# EAGLE design SC card holder v2.6 (EAGLE 8.3.1)
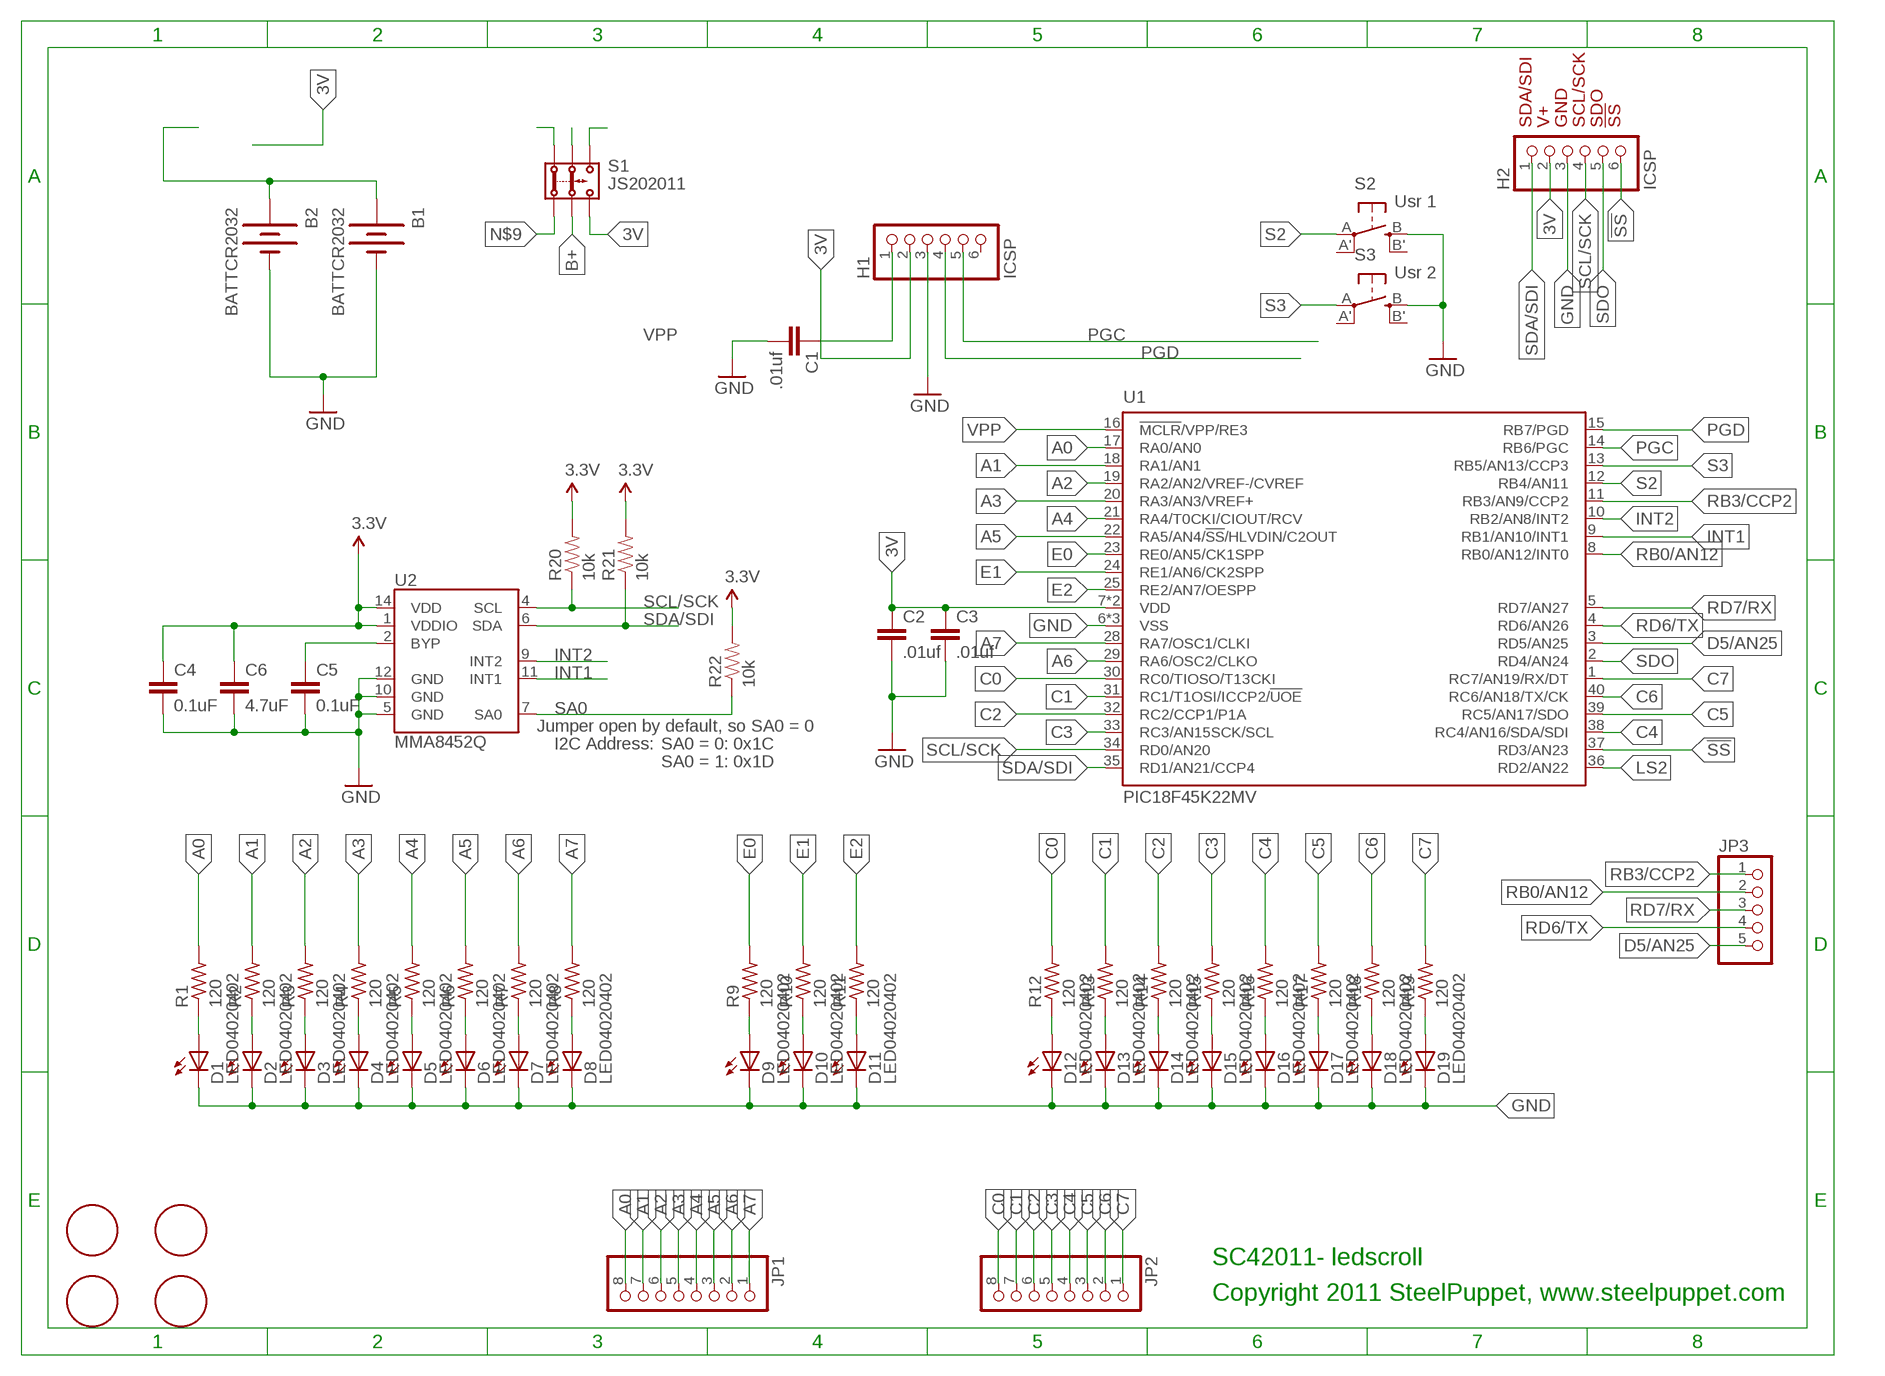
[diagram p0: schematic, sheet 1]

## Parts
B1  BATTCR2032  [BATT_CR1220_SMT]
B2  BATTCR2032  [BATT_CR1220_SMT]
C1  .01uf  CAP0402-CAP  [0402-CAP]
C2  .01uf  CAP0402-CAP  [0402-CAP]
C3  .01uf  CAP0402-CAP  [0402-CAP]
C4  0.1uF  CAP0402-CAP  [0402-CAP]
C5  0.1uF  CAP0402-CAP  [0402-CAP]
C6  4.7uF  CAP0402-CAP  [0402-CAP]
D1  LED04020402  [LED0402]
D2  LED04020402  [LED0402]
D3  LED04020402  [LED0402]
D4  LED04020402  [LED0402]
D5  LED04020402  [LED0402]
D6  LED04020402  [LED0402]
D7  LED04020402  [LED0402]
D8  LED04020402  [LED0402]
D9  LED04020402  [LED0402]
D10  LED04020402  [LED0402]
D11  LED04020402  [LED0402]
D12  LED04020402  [LED0402]
D13  LED04020402  [LED0402]
D14  LED04020402  [LED0402]
D15  LED04020402  [LED0402]
D16  LED04020402  [LED0402]
D17  LED04020402  [LED0402]
D18  LED04020402  [LED0402]
D19  LED04020402  [LED0402]
H1  ICSP  PINHD-1X06_2.54-S  [1X06-S]
H2  ICSP  PINHD-1X06_2.54-S  [1X06-S]
JP1  PINHD-1X08_2.54-S  [1X08-S]
JP2  PINHD-1X08_2.54-S  [1X08-S]
JP3  PINHD-1X05_2.54-S  [1X05-S]
R1  120  R-US_R0402  [R0402]
R2  120  R-US_R0402  [R0402]
R3  120  R-US_R0402  [R0402]
R4  120  R-US_R0402  [R0402]
R5  120  R-US_R0402  [R0402]
R6  120  R-US_R0402  [R0402]
R7  120  R-US_R0402  [R0402]
R8  120  R-US_R0402  [R0402]
R9  120  R-US_R0402  [R0402]
R10  120  R-US_R0402  [R0402]
R11  120  R-US_R0402  [R0402]
R12  120  R-US_R0402  [R0402]
R13  120  R-US_R0402  [R0402]
R14  120  R-US_R0402  [R0402]
R15  120  R-US_R0402  [R0402]
R16  120  R-US_R0402  [R0402]
R17  120  R-US_R0402  [R0402]
R18  120  R-US_R0402  [R0402]
R19  120  R-US_R0402  [R0402]
R20  10k  RESISTOR0402-RES  [0402-RES]
R21  10k  RESISTOR0402-RES  [0402-RES]
R22  10k  RESISTOR0402-RES  [0402-RES]
S1  JS202011  [JS202011SMT]
S2  Usr 1  SPST_TACT-EVQQ2  [EVQ-Q2]
S3  Usr 2  SPST_TACT-EVQQ2  [EVQ-Q2]
U1  PIC18F45K22MV  [QFN40-5X5]
U2  MMA8452Q  [QFN-16_0.5MM]
U$4  FID1.5  [FID1.5]
U$5  FID1.5  [FID1.5]
U$6  FID1.5  [FID1.5]
U$7  FID1.5  [FID1.5]

## Nets
3V: C2.1 C3.1 C4.1 C6.1 H1.2 H2.2 R20.2 R21.2 R22.2 S1.3(3.2) S1.4(3.1) U1.7(VDD) U1.26(VDD) U2.1(VDDIO) U2.14(VDD) ; supply symbol labelled 3.3V
!SS: H2.6 U1.37(RD3/AN23)
A0: JP1.8 R1.2 U1.17(RA0/AN0)
A1: JP1.7 R2.2 U1.18(RA1/AN1)
A2: JP1.6 R3.2 U1.19(RA2/AN2/VREF-/CVREF)
A3: JP1.5 R4.2 U1.20(RA3/AN3/VREF+)
A4: JP1.4 R5.2 U1.21(RA4/T0CKI/CIOUT/RCV)
A5: JP1.3 R6.2 U1.22(RA5/AN4/!SS!/HLVDIN/C2OUT)
A6: JP1.2 R7.2 U1.29(RA6/OSC2/CLKO)
A7: JP1.1 R8.2 U1.28(RA7/OSC1/CLKI)
B+: B1.1(+) B1.3(+) B2.1(+) B2.3(+) S1.2(2.2) S1.5(2.1)
BYP: C5.1 U2.2(BYP)
C0: JP2.8 R12.2 U1.30(RC0/TIOSO/T13CKI)
C1: JP2.7 R13.2 U1.31(RC1/T1OSI/ICCP2/!UOE)
C2: JP2.6 R14.2 U1.32(RC2/CCP1/P1A)
C3: JP2.5 R15.2 U1.33(RC3/AN15SCK/SCL)
C4: JP2.4 R16.2 U1.38(RC4/AN16/SDA/SDI)
C5: JP2.3 R17.2 U1.39(RC5/AN17/SDO)
C6: JP2.2 R18.2 U1.40(RC6/AN18/TX/CK)
C7: JP2.1 R19.2 U1.1(RC7/AN19/RX/DT)
D5/AN25: JP3.5 U1.3(RD5/AN25)
E0: R9.2 U1.23(RE0/AN5/CK1SPP)
E1: R10.2 U1.24(RE1/AN6/CK2SPP)
E2: R11.2 U1.25(RE2/AN7/OESPP)
GND: B1.2(-) B2.2(-) C1.2 C2.2 C3.2 C4.2 C5.2 C6.2 D1.C D2.C D3.C D4.C D5.C D6.C D7.C D8.C D9.C D10.C D11.C D12.C D13.C D14.C D15.C D16.C D17.C D18.C D19.C H1.3 H2.3 S2.B(S) S3.B(S) U1.6(VSS) U1.27(VSS) U1.41(VSS) U2.5(GND) U2.10(GND) U2.12(GND)
INT1: U1.9(RB1/AN10/INT1) U2.11(INT1)
INT2: U1.10(RB2/AN8/INT2) U2.9(INT2)
LS2: U1.36(RD2/AN22)
N$2: D1.A R1.1
N$3: D2.A R2.1
N$4: D3.A R3.1
N$5: D4.A R4.1
N$6: D9.A R9.1
N$7: D10.A R10.1
N$8: D11.A R11.1
N$9: S1.1(1.2)
N$11: D13.A R13.1
N$12: D14.A R14.1
N$13: D15.A R15.1
N$14: D12.A R12.1
N$15: S1.6(1.1)
N$18: D6.A R6.1
N$20: D7.A R7.1
N$21: D16.A R16.1
N$22: D17.A R17.1
N$23: D8.A R8.1
N$24: D5.A R5.1
N$25: D18.A R18.1
N$26: D19.A R19.1
PGC: H1.5 U1.14(RB6/PGC)
PGD: H1.4 U1.15(RB7/PGD)
RB0/AN12: JP3.2 U1.8(RB0/AN12/INT0)
RB3/CCP2: JP3.1 U1.11(RB3/AN9/CCP2)
RD6/TX: JP3.4 U1.4(RD6/AN26)
RD7/RX: JP3.3 U1.5(RD7/AN27)
S2: S2.A(P) U1.12(RB4/AN11)
S3: S3.A(P) U1.13(RB5/AN13/CCP3)
SA0: R22.1 U2.7(SA0)
SCL/SCK: H2.4 R20.1 U1.34(RD0/AN20) U2.4(SCL)
SDA/SDI: H2.1 R21.1 U1.35(RD1/AN21/CCP4) U2.6(SDA)
SDO: H2.5 U1.2(RD4/AN24)
VPP: C1.1 H1.1 U1.16(!MCLR!/VPP/RE3)
Unconnected: H1.6 S2.A'(P1) S2.B'(S1) S3.A'(P1) S3.B'(S1)

## Notes on the sheet
- SDA/SDI | V+ | GND | SCL/SCK | SDO | !SS
- Jumper open by default, so SA0 = 0
- I2C Address: | SA0 = 0: 0x1C
- SA0 = 1: 0x1D
- SC42011- ledscroll
- Copyright 2011 SteelPuppet, www.steelpuppet.com

## Library data of the parts
B1 B2 = dfb-parts:BATTCR2032
C1-C6 = SparkFun:CAP: Capacitor Standard 0603 ceramic capacitor, and 0.1" leaded capacitor.
D1-D19 = dfb-parts:LED0402
H1 H2 = pinhead-2:PINHD-1X06: PIN HEADER
JP1 JP2 = pinhead-2:PINHD-1X08: PIN HEADER
JP3 = pinhead-2:PINHD-1X05: PIN HEADER
R1-R19 = rcl:R-US_: RESISTOR, American symbol
R20-R22 = SparkFun:RESISTOR: Resistor Basic schematic elements and footprints for 0603, 1206, and PTH resistors.
S1 = dfb-parts:JS202011
S2 S3 = adafruit:SPST_TACT: SMT 6mm switch, EVQQ2 series http://www.ladyada.net/library/eagle
U1 = dfb-parts:PIC18F45K22
U2 = SparkFun:MMA8452Q: MMA8452Q 3-Axis, 12/8-bit Digital Accelerometer Supply Voltage: 1.6-3.6V Range: +/- 2g, 4g, 8g Interface: I2C, 12-bit and 8-bit ODR: 1.56 Hz - 800 Hz Package: QFN-16 http://cache.freescale.com/files/sensors/doc/data_sheet/MMA8452Q.pdf
U$4-U$7 = dfb-parts:FID1.5

## Board
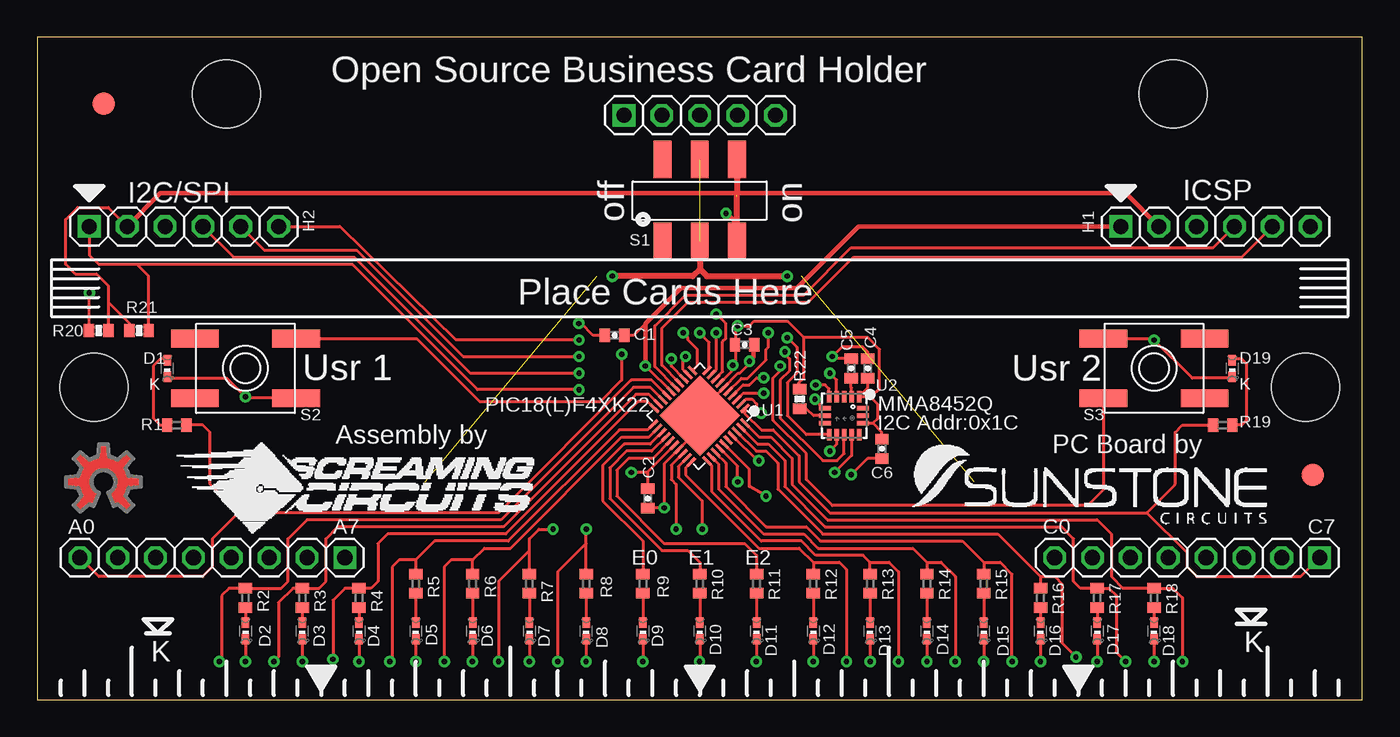
[diagram p1: board, top side]
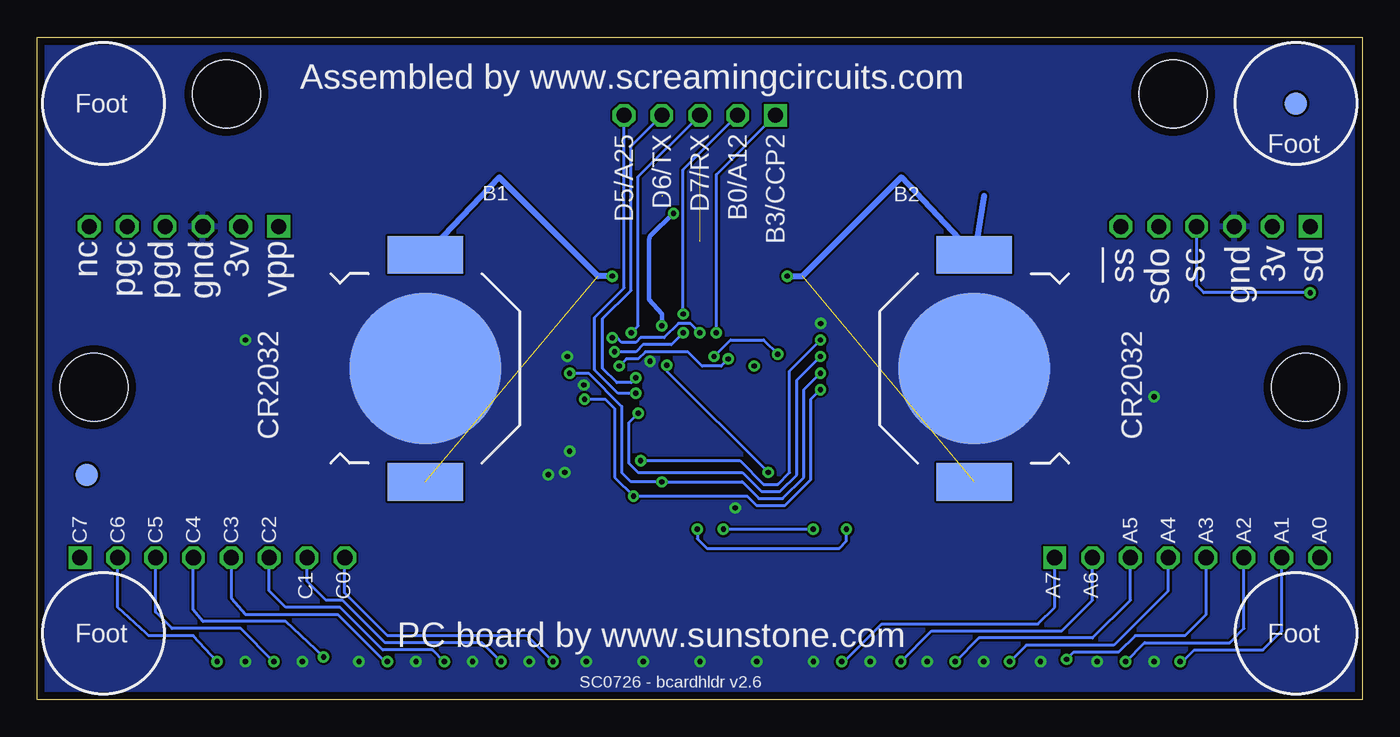
[diagram p2: board, bottom side, seen from below]

Size 88.9 x 44.45 mm. Coordinates in mm from the lower left corner, seen from the top.
Outline: 0,44.45 0,0 88.9,0 88.9,44.45 0,44.45
Copper layers (1*16): Top 0.0178mm / dielectric 59mil / Bottom 0.0178mm
Design rules "SSC-EAGLE-2Lyr_v1.0.0.3": minimum track width 6mil, minimum drill 14mil, track to track 6mil, track to pad 6mil, pad to pad 6mil, via to via 6mil, smd to smd 6mil, copper to edge 20mil, drill to drill 16mil, minimum pad ring 8mil, minimum via ring 8mil, stop-mask expansion 3mil, vias tented up to drill 0mil, thermal gap 10mil
Holes 4.57 mm at 85.09,20.95 76.2,40.64 12.7,40.64 3.81,20.95

### Footprints (pad centres in the part's own frame; a part is rotated, then mirrored left to right if it is on the bottom)
BATT_CR1220_SMT = smd 2.54 x 5.08: 1 -7.62,0; 3 7.62,0 | smd 10.16 x 10.16: 2 0,0
0402-CAP = smd 0.7 x 0.9: 1 -0.65,0; 2 0.65,0
LED0402 = smd 0.7 x 0.5: A 0.55,0; C -0.55,0
1X06-S = drill 1.016 square: 1 -6.35,0 | drill 1.016 octagon: 2 -3.81,0; 3 -1.27,0; 4 1.27,0; 5 3.81,0; 6 6.35,0
1X08-S = drill 1.016 square: 1 -8.89,0 | drill 1.016 octagon: 2 -6.35,0; 3 -3.81,0; 4 -1.27,0; 5 1.27,0; 6 3.81,0; 7 6.35,0; 8 8.89,0
1X05-S = drill 1.016 square: 1 -5.08,0 | drill 1.016 octagon: 2 -2.54,0; 3 0,0; 4 2.54,0; 5 5.08,0
R0402 = smd 0.7 x 0.9: 1 -0.65,0; 2 0.65,0
0402-RES = smd 0.7 x 0.9: 1 -0.65,0; 2 0.65,0
JS202011SMT = smd 2.502 x 1.194: 1 -2.75,2.489; 2 -2.75,0; 3 -2.75,-2.489; 4 2.75,-2.489; 5 2.75,0; 6 2.75,2.489
EVQ-Q2 = smd 3.2 x 1.2: A -3.4,-2; A' 3.4,-2; B -3.4,2; B' 3.4,2
QFN40-5X5 = smd 0.75 x 0.2: 1 -2.5,1.8; 2 -2.5,1.4; 3 -2.5,1; 4 -2.5,0.6; 5 -2.5,0.2; 6 -2.5,-0.2; 7 -2.5,-0.6; 8 -2.5,-1; 9 -2.5,-1.4; 10 -2.5,-1.8; 21 2.6,-1.8; 22 2.6,-1.4; 23 2.6,-1; 24 2.6,-0.6; 25 2.6,-0.2; 26 2.6,0.2; 27 2.6,0.6; 28 2.6,1; 29 2.6,1.4; 30 2.6,1.8 | smd 0.2 x 0.75: 11 -1.8,-2.5; 12 -1.4,-2.5; 13 -1,-2.5; 14 -0.6,-2.5; 15 -0.2,-2.5; 16 0.2,-2.5; 17 0.6,-2.5; 18 1,-2.5; 19 1.4,-2.5; 20 1.8,-2.5; 31 1.8,2.5; 32 1.4,2.5; 33 1,2.5; 34 0.6,2.5; 35 0.2,2.5; 36 -0.2,2.5; 37 -0.6,2.5; 38 -1,2.5; 39 -1.4,2.5; 40 -1.8,2.5 | smd 3.8 x 3.8: 41 0,0
QFN-16_0.5MM = smd 0.8 x 0.3: 1 -1.275,1; 2 -1.275,0.5; 3 -1.275,0; 4 -1.275,-0.5; 5 -1.275,-1; 9 1.275,-1; 10 1.275,-0.5; 11 1.275,0; 12 1.275,0.5; 13 1.275,1 | smd 0.3 x 0.8: 6 -0.5,-1.275; 7 0,-1.275; 8 0.5,-1.275; 14 0.5,1.275; 15 0,1.275; 16 -0.5,1.275
FID1.5 = smd 1.5 x 1.5: P$1 0,0

### Placement (x,y rotation side)
B1  62.87,22.23 90 bottom
B2  26.04,22.23 270 bottom
C1  38.73,24.45 180 top
C2  40.96,13.49 270 top
C3  47.47,23.81 0 top
C4  55.72,22.23 90 top
C5  54.61,22.23 90 top
C6  56.67,16.83 270 top
D1  8.73,22.23 90 top
D2  13.97,4.6 90 top
D3  17.78,4.6 90 top
D4  21.59,4.6 90 top
D5  25.4,4.6 90 top
D6  29.21,4.6 90 top
D7  33.02,4.6 90 top
D8  36.83,4.6 90 top
D9  40.64,4.6 90 top
D10  44.45,4.6 90 top
D11  48.26,4.6 90 top
D12  52.07,4.6 90 top
D13  55.88,4.6 90 top
D14  59.69,4.6 90 top
D15  63.5,4.6 90 top
D16  67.31,4.6 90 top
D17  71.12,4.6 90 top
D18  74.93,4.6 90 top
D19  80.17,22.23 90 top
H1  79.06,31.75 0 top
H2  9.84,31.75 0 top
JP1  11.75,9.53 180 top
JP2  77.15,9.53 180 top
JP3  44.45,39.21 0 top
R1  9.37,18.41 0 top
R2  13.97,6.83 90 top
R3  17.78,6.83 90 top
R4  21.59,6.83 90 top
R5  25.4,7.78 90 top
R6  29.21,7.78 90 top
R7  33.02,7.78 90 top
R8  36.83,7.78 90 top
R9  40.64,7.78 90 top
R10  44.45,7.78 90 top
R11  48.26,7.78 90 top
R12  52.07,7.78 90 top
R13  55.88,7.78 90 top
R14  59.69,7.78 90 top
R15  63.5,7.78 90 top
R16  67.31,6.83 90 top
R17  71.12,6.83 90 top
R18  74.93,6.83 90 top
R19  79.53,18.41 180 top
R20  4.13,24.77 0 top
R21  6.83,24.77 180 top
R22  51.16,20.16 90 top
S1  44.45,33.5 90 top
S2  13.97,22.23 180 top
S3  74.93,22.23 0 top
U1  44.45,19.05 225 top
U2  54.13,19.05 270 top
U$1  [SUNSTONE-LOGO]  70.48,13.97 0 top
U$2  [OSHWLOGO_TOP_0.2]  4.45,14.61 0 top
U$3  [SC-LOGO]  22.7,13.65 0 top
U$4  4.45,40.01 0 top
U$5  85.57,15.08 0 top
U$6  4.45,40.01 0 bottom
U$7  85.57,15.08 0 bottom

### Tracks (layer width: path | path; a pad name or v marks a point on that pad's centre or on a via)
3V  (via drill 0.36)  (1 unrouted)
  Top 0.203: C2.1 40.96,15.28 U1.26 40.92,15.24 v39.85,15.24 | U1.7 46.67,22.12 v46.67,22.44 46.83,22.54 46.83,23.65 C3.1 | 46.87,24.01 46.87,24.96 | v46.99,25.08 47.78,25.08 48.1,25.4 50.32,25.4 51.44,24.29 | H2.2 4.76,33.02 2.7,33.02 1.91,32.23 1.91,29.21 2.56,28.56 3.98,28.56 4.76,27.78 4.76,26.67 | U2.14 56.06,18.55 | C6.1 56.67,17.94 56.06,18.55 | 55.88,20.32 U2.1 55.13,20.37 55.72,20.95 C4.1 | 55.88,20.32 56.36,19.84 56.36,18.84 56.06,18.55 | 55.88,20.32 56.52,20.8 56.52,23.5 55.72,24.29 51.44,24.29 | R22.2 51.12,21.27 51.44,21.59 51.44,24.29 | 4.76,26.67 4.76,25.26 R20.2 | R21.2 6.21,24.75 6.19,25.24 4.76,26.67
  Top 0.305: H1.2 73.03,33.97 46.99,33.97 8.26,33.97 H2.2 | C3.1 46.83,23.97 46.87,24.01 | 46.87,24.96 v46.99,25.08 | v46.21,32.63 47,31.92 S1.3
  Top 0.406: S1.3 46.94,33.76 46.99,33.97 | S1.4 46.94,33.87
  Bottom 0.203: v46.67,22.44 46.67,22.07 v39.85,15.24
  Bottom 0.305: v46.99,25.08 46.99,25.88 47.87,26.83 47.87,30.88 47.78,31.11 v46.21,32.63
!SS  (via drill 0.36)
  Top 0.203: U1.37 48.31,16.03 v48.42,16.03 | H2.6 20.32,31.75 28.1,24.13 v36.35,24.13
  Bottom 0.203: v48.42,16.03 41.75,16.03 40.16,14.45 39.21,14.45 38.42,15.24 38.42,22.07 v36.35,24.13
A0
  Top 0.203: U1.17 41.22,21.43 39.85,21.43 30.96,12.54 13.49,12.54 | 13.49,12.54 11.75,10.79 11.75,8.89 11.11,8.26 4.13,8.26 JP1.8 | 13.49,12.54 11.59,14.45 11.59,17.94 11.11,18.41 R1.2
A1  (via drill 0.36)
  Top 0.203: U1.18 41.13,20.95 40.01,20.95 31.11,12.06 18.1,12.06 16.83,10.79 16.83,7.94 16.37,7.48 R2.2 12.87,7.48 12.38,6.99 12.38,2.7 v12.22,2.54
  Bottom 0.203: v12.22,2.54 12.06,2.54 11.27,3.33 6.67,3.33 5.4,4.6 JP1.7
A2  (via drill 0.36)
  Top 0.203: U1.19 41.04,20.48 40.16,20.48 31.27,11.59 20.16,11.59 19.37,10.79 19.37,7.94 18.91,7.48 R3.2 17.16,7.48 16.19,6.51 16.19,2.86 v15.88,2.54
  Bottom 0.203: v15.88,2.54 14.61,3.81 8.89,3.81 7.94,4.76 JP1.6
A3  (via drill 0.36)
  Top 0.203: U1.20 40.95,20 40.32,20 31.43,11.11 23.5,11.11 22.86,10.48 22.86,7.94 22.4,7.48 R4.2 20.65,7.48 19.84,6.67 v19.84,2.7
  Bottom 0.203: JP1.5 10.48,5.71 11.91,4.29 15.24,4.29 16.35,3.17 19.37,3.17 v19.84,2.7
A4  (via drill 0.36)
  Top 0.203: U1.21 40.95,18.1 39.05,18.1 31.59,10.64 26.67,10.64 25.4,9.37 | 25.4,9.37 R5.2 | 25.4,9.37 24.29,9.37 23.81,8.89 23.81,2.7 v23.65,2.54
  Bottom 0.203: JP1.4 13.02,7.3 16.67,3.65 22.54,3.65 v23.65,2.54
A5  (via drill 0.36)
  Top 0.203: U1.22 41.04,17.62 39.21,17.62 31.75,10.16 30,10.16 29.21,9.37 | R6.2 29.21,9.37 | 29.21,9.37 27.78,9.37 27.3,8.89 v27.3,2.54
  Bottom 0.203: JP1.3 15.56,6.67 18.1,4.13 25.72,4.13 v27.3,2.54
A6  (via drill 0.36)
  Top 0.203: U1.29 43.02,15.64 43.02,14.92 44.61,13.34 v44.61,11.43 | R7.2 33.02,10 | 33.02,10 33.02,10.79 33.66,11.43 v34.61,11.43 | 33.02,10 30.96,7.94 v30.96,2.54
  Bottom 0.203: v44.61,11.43 44.61,10.79 43.97,10.16 35.08,10.16 34.61,10.64 v34.61,11.43 | v30.96,2.54 28.89,4.6 20.16,4.6 18.1,6.67 JP1.2
A7  (via drill 0.36)
  Top 0.203: U1.28 42.55,15.73 42.55,14.76 42.86,14.45 v42.86,11.43 | R8.2 36.83,10.48 | 36.83,10.48 v36.83,11.43 | 36.83,10.48 34.92,8.57 v34.92,2.54
  Bottom 0.203: v36.83,11.43 v42.86,11.43 | v34.92,2.54 34.77,2.54 32.23,5.08 21.75,5.08 20.64,6.19 JP1.1
B+  (via drill 0.36)  (3 unrouted)
  Top 0.406: S1.2 44.45,28.89 | 44.45,28.89 43.97,28.42 v38.58,28.42 | 44.45,28.89 44.93,28.42 v50.32,28.42
  Bottom 0.406: 25.37,33.81 B2.1 30.92,35.05 37.56,28.42 v38.58,28.42 | v50.32,28.42 51.28,28.42 57.91,35.05 B1.3
BYP
  Top 0.203: U2.2 54.63,20.93 54.61,20.95 C5.1
C0  (via drill 0.36)
  Top 0.203: U1.30 43.5,15.55 43.5,15.08 48.42,10.16 51.12,10.16 52.07,9.21 | 52.07,9.21 R12.2 | 52.07,9.21 53.82,9.21 54.29,8.73 v54.29,2.54
  Bottom 0.203: v54.29,2.54 56.04,4.29 65.41,4.29 68.26,7.14 JP2.8
C1  (via drill 0.36)
  Top 0.203: R13.2 55.88,9.21 | 55.88,9.21 55.4,9.68 52.23,9.68 51.28,10.64 48.57,10.64 46.19,13.02 45.24,13.97 45.24,15.71 U1.31 | 55.88,9.21 57.15,9.21 57.78,8.57 v57.78,2.54
  Bottom 0.203: v57.78,2.54 59.05,3.81 65.56,3.81 68.42,6.67 69.53,6.67 70.8,7.94 JP2.7
C2  (via drill 0.36)
  Top 0.203: 59.69,9.21 58.74,10.16 52.39,10.16 51.44,11.11 48.74,11.11 45.72,14.13 45.72,15.8 U1.32 | 59.69,9.21 R14.2 | 59.69,9.21 60.64,9.21 61.59,8.26 v61.59,2.54
  Bottom 0.203: JP2.6 73.34,7.3 72.23,6.19 68.58,6.19 65.72,3.33 62.39,3.33 v61.59,2.54
C3  (via drill 0.36)
  Top 0.203: U1.33 45.51,16.56 46.2,15.88 46.2,14.29 48.9,11.59 51.59,11.59 52.55,10.64 62.07,10.64 63.5,9.21 | 63.5,9.21 R15.2 | v65.41,2.54 65.41,8.41 64.61,9.21 63.5,9.21
  Bottom 0.203: JP2.5 75.88,6.83 74.93,5.71 68.74,5.71 65.56,2.54 v65.41,2.54
C4  (via drill 0.36)
  Top 0.203: U1.38 48.24,16.67 48.9,16.67 49.69,15.88 49.69,14.13 52.7,11.11 64.45,11.11 67.31,8.26 | 67.31,8.26 R16.2 | 67.31,8.26 68.26,8.26 68.74,7.78 68.74,3.81 v69.69,2.86
  Bottom 0.203: JP2.4 78.42,6.03 77.79,5.24 72.23,5.24 v69.69,2.86
C5  (via drill 0.36)
  Top 0.203: U1.39 48.34,17.14 49.05,17.14 50.16,16.03 50.16,14.29 52.86,11.59 68.74,11.59 69.53,10.79 69.53,7.94 69.99,7.48 R17.2 71.9,7.48 72.39,6.99 72.39,3.17 v73.03,2.54
  Bottom 0.203: JP2.3 80.96,5.87 79.85,4.76 75.25,4.76 v73.03,2.54
C6  (via drill 0.36)
  Top 0.203: U1.40 48.42,17.62 49.21,17.62 50.64,16.19 50.64,14.45 53.02,12.06 71.12,12.06 72.07,11.11 72.07,8.26 72.85,7.48 R18.2 76.19,7.48 76.83,6.83 v76.83,2.54
  Bottom 0.203: JP2.2 83.5,6.19 81.6,4.45 81.44,4.29 78.42,4.29 v76.83,2.54
C7
  Top 0.203: U1.1 47.47,19.37 47.47,19.21 48.58,18.1 49.37,18.1 51.12,16.35 51.12,14.61 53.18,12.54 74.45,12.54 | 74.45,12.54 77.15,9.84 77.15,8.89 77.79,8.26 84.77,8.26 JP2.1 | 74.45,12.54 76.36,14.45 76.36,17.94 76.83,18.41 R19.2
D5/AN25  (via drill 0.36)
  Top 0.203: v48.74,20.55 47.36,20.55 U1.3
  Bottom 0.203: v48.74,20.55 49.92,20.55 51.5,22.13 51.5,25.65 49.53,27.62 JP3.5
E0
  Top 0.203: U1.23 41.12,17.14 39.37,17.14 37.94,15.72 37.94,13.34 40.64,10.64 R9.2
E1
  Top 0.203: R10.2 44.45,9.21 43.66,10 41.91,10 38.42,13.49 38.42,15.56 39.53,16.67 41.22,16.67 U1.24
E2
  Top 0.203: R11.2 48.26,9.68 47.47,10.48 42.07,10.48 38.89,13.65 38.89,15.4 39.69,16.19 41.31,16.19 U1.25
GND  (via drill 0.36)
  Top 0.203: C2.2 40.99,12.86 v42.07,12.86 42.07,15.82 U1.27 44.45,18.2 U1.41 44.45,19.33 U1.6 47.02,21.91 47.15,21.91 47.78,22.54 v47.78,22.7 48.07,22.98 | C3.2 47.94,23.5 48.07,23.62 | C1.2 37.31,24.45 36.51,25.24 v36.34,25.24 | D18.C v74.93,2.54 | D17.C v71.12,2.54 | D16.C v67.31,2.54 | D15.C v63.5,2.54 v63.49,2.54 | D14.C v59.69,2.54 | D13.C v55.88,2.54 | D12.C 52.07,2.55 v52.06,2.54 | D11.C 48.26,2.55 v48.25,2.54 | D10.C 44.45,2.55 v44.44,2.54 | D9.C 40.64,2.55 v40.63,2.54 | D8.C 36.83,2.55 v36.82,2.54 | D7.C 33.02,2.55 v33.01,2.54 | D6.C 29.21,2.55 v29.2,2.54 | D5.C v25.4,2.54 | D4.C v21.59,2.54 | D3.C v17.78,2.54 | D2.C v13.97,2.54 | U2.10 53.63,17.12 v53.18,16.67 | U2.12 54.63,16.38 v53.5,15.24 | U2.5 53.13,20.84 52.86,21.11 v52.23,21.11 | C5.2 53.48,22.88 v53.34,23.02 53.98,23.65 55.4,23.65 55.72,23.34 C4.2 | C6.2 55.71,16.18 v54.61,15.08 | S3.B 74.83,24.23 v74.93,24.13 77.48,21.57 80.15,21.57 80.17,21.59 D19.C | S2.B 13.91,20.23 v13.97,20.32 12.71,21.57 8.9,21.57 8.89,21.59 D1.C
  Top 0.305: 48.07,23.62 48.07,22.98
  pour Bottom: 88.9,44.45 0,44.45 0,0 88.9,0
INT1  (via drill 0.36)
  Top 0.203: U1.9 45.56,22.14 v45.56,24.61 | v50.16,23.34 50.16,23.18 50.48,22.86 50.48,22.07 49.85,21.43 49.85,18.89 52.7,16.03 53.66,16.03 54.13,16.51 U2.11
  Bottom 0.203: v45.56,24.61 46.35,23.81 48.26,23.81 48.74,23.34 v50.16,23.34
INT2  (via drill 0.36)
  Top 0.203: U1.10 45.09,22.23 45.09,23.97 v44.45,24.61 | v50.32,24.29 50.96,23.65 50.96,21.91 50.32,21.27 50.32,19.05 51.6,17.77 U2.9
  Bottom 0.203: v44.45,24.61 45.09,25.24 45.88,25.24 46.83,24.29 48.42,24.29 48.74,23.97 49.69,23.97 50.01,24.29 v50.32,24.29
N$2
  Top 0.203: D1.A 8.73,22.86 8.27,22.88 7.78,22.38 7.78,18.89 8.26,18.41 R1.1
N$3
  Top 0.203: R2.1 D2.A
N$4
  Top 0.203: R3.1 D3.A
N$5
  Top 0.203: R4.1 D4.A
N$6
  Top 0.203: R9.1 D9.A
N$7
  Top 0.203: R10.1 D10.A
N$8
  Top 0.203: R11.1 D11.A
N$11
  Top 0.203: R13.1 D13.A
N$12
  Top 0.203: R14.1 D14.A
N$13
  Top 0.203: R15.1 D15.A
N$14
  Top 0.203: R12.1 D12.A
N$18
  Top 0.203: R6.1 D6.A
N$20
  Top 0.203: R7.1 D7.A
N$21
  Top 0.203: R16.1 D16.A
N$22
  Top 0.203: R17.1 D17.A
N$23
  Top 0.203: R8.1 D8.A
N$24
  Top 0.203: R5.1 D5.A
N$25
  Top 0.203: R18.1 D18.A
N$26
  Top 0.203: D19.A 80.17,22.86 80.18,22.88 80.79,22.88 81.12,22.54 81.12,18.73 80.8,18.41 R19.1
PGC
  Top 0.203: U1.14 41.91,22.44 41.91,24.92 43.66,26.67 51.75,26.67 54.77,29.69 80.8,29.69 H1.5
PGD
  Top 0.203: U1.15 41.43,22.35 41.43,25.08 43.5,27.15 51.44,27.15 54.61,30.32 78.9,30.32 H1.4
RB0/AN12  (via drill 0.36)
  Top 0.203: U1.8 45.99,22 45.99,24.02 46.2,24.23 46.2,25.24 v45.56,25.88
  Bottom 0.203: v45.56,25.88 45.56,35.56 JP3.2
RB3/CCP2  (via drill 0.36)
  Top 0.203: U1.11 44.29,22.43 44.29,23.5 43.66,24.13 43.66,24.29 v43.34,24.61
  Bottom 0.203: v43.34,24.61 43.34,35.24 JP3.1
RD6/TX  (via drill 0.36)
  Top 0.203: v48.74,21.59 48.26,21.59 47.78,21.11 47.36,21.11 U1.4
  Bottom 0.203: v48.74,21.59 49.05,21.27 50.01,21.27 50.96,22.23 50.96,25.56 49.05,27.46 49.05,37.15 JP3.4
RD7/RX  (via drill 0.36)
  Top 0.203: U1.5 47.23,21.55 47.66,21.55 48.9,22.79 48.9,23.5 49.05,23.65 v49.05,24.61
  Bottom 0.203: v49.05,24.61 48.58,25.08 48.58,35.08 JP3.3
S2  (via drill 0.36)
  Top 0.203: U1.12 43.34,22.14 43.34,22.86 v43.5,23.02 | v39.21,23.18 39.21,21.43 37.78,20 29.69,20 25.46,24.23 S2.A
  Bottom 0.203: v43.5,23.02 42.39,24.13 40.16,24.13 v39.21,23.18
S3  (via drill 0.36)
  Top 0.203: v49.85,22.38 49.85,22.07 49.37,21.59 49.37,18.73 51.59,16.51 51.59,14.76 53.34,13.02 70.48,13.02 71.53,14.06 S3.A | U1.13 42.55,22.37 v42.55,22.86
  Bottom 0.203: v42.55,22.86 43.02,22.38 44.29,22.38 45.24,23.34 48.1,23.34 48.58,22.86 49.37,22.86 v49.85,22.38
SA0
  Top 0.203: U2.7 52.09,19.05 51.59,19.51 R22.1
SCL/SCK  (via drill 0.36)
  Top 0.203: U1.34 46.99,15.66 v46.99,14.61 | H2.4 13.18,29.69 21.27,29.69 29.05,21.91 v36.35,21.91 | U2.4 53.63,21.45 v53.18,21.91 | R20.1 v3.49,27.3
  Bottom 0.203: v36.35,21.91 37.47,20.8 37.47,14.92 38.89,13.49 40.48,13.49 41.59,14.61 v46.99,14.61 49.05,14.61 49.69,15.24 49.69,19.68 51.91,21.91 v53.18,21.91 | v3.49,27.3 10.64,27.3 11.11,27.78 H2.4
SDA/SDI  (via drill 0.36)
  Top 0.203: U1.35 47.78,15.43 47.78,14.29 v48.9,13.65 | H2.1 3.49,29.84 4.13,29.21 6.67,29.21 | 6.67,29.21 21.11,29.21 29.53,20.8 v36.35,20.8 | U2.6 52.68,19.55 v52.18,20.16 | R21.1 7.46,28.42 6.67,29.21
  Bottom 0.203: v36.35,20.8 36.99,20.16 36.99,14.76 38.73,13.02 40.64,13.02 41.27,13.65 v48.9,13.65 50.16,14.92 50.16,19.53 50.8,20.16 v52.18,20.16
SDO  (via drill 0.36)
  Top 0.203: U1.2 47.54,20.16 47.94,20.16 48.26,19.84 48.26,19.53 v48.58,19.21 | H2.5 15.24,30.16 21.43,30.16 28.57,23.02 v36.35,23.02
  Bottom 0.203: v48.58,19.21 49.21,18.57 49.21,15.88 48.58,15.24 41.59,15.24 40.32,13.97 39.05,13.97 37.94,15.08 37.94,21.43 v36.35,23.02
VPP  (via drill 0.36)
  Top 0.203: U1.16 40.99,22.23 v40.8,22.38 | 40.8,25.24 40.01,24.45 C1.1
  Top 0.305: H1.1 55.09,31.75 50.96,27.62 43.18,27.62 40.8,25.24 v40.8,22.38

### Text on the board
tPlace: Open Source Business Card Holder | on | I2C/SPI | ICSP | off | Place Cards Here | Usr 2 | K | Usr 1 | K | PIC18(L)F4XK22 | MMA8452Q | I2C Addr:0x1C | Assembly by | PC Board by | A0 | A7 | C0 | C7 | E0 | E1 | E2 | K | K
bPlace: Assembled by www.screamingcircuits.com | Foot | B3/CCP2 | B0/A12 | D7/RX | D6/TX | D5/A25 | Foot | vpp | 3v | gnd | pgd | pgc | nc | sd | 3v | gnd | sc | sdo | !ss | CR2032 | CR2032 | A0 | A1 | A2 | A3 | A4 | A5 | C2 | C3 | C4 | C5 | C6 | C7 | A6 | A7 | C0 | C1 | Foot | Foot | PC board by www.sunstone.com | SC0726 - bcardhldr v2.6
tNames: U1
tDocu: Red | Grn | Red | Grn | Red | Grn | Red | Grn | Red | Grn | Red | Grn | Red | Grn | Red | Grn | Red | Grn | Red